# EasyEDA Pro project ProProject_zelda_guardian.epro, board main_pcb
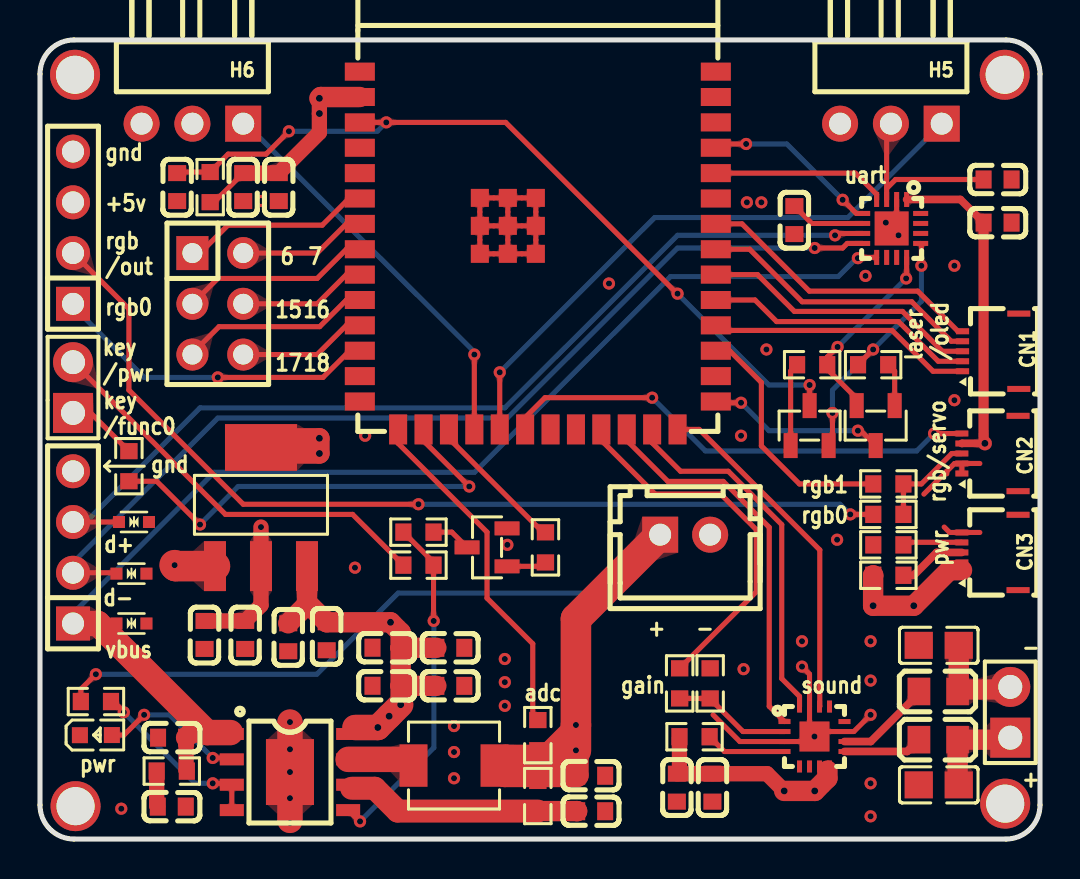
[diagram p10: board, top side]
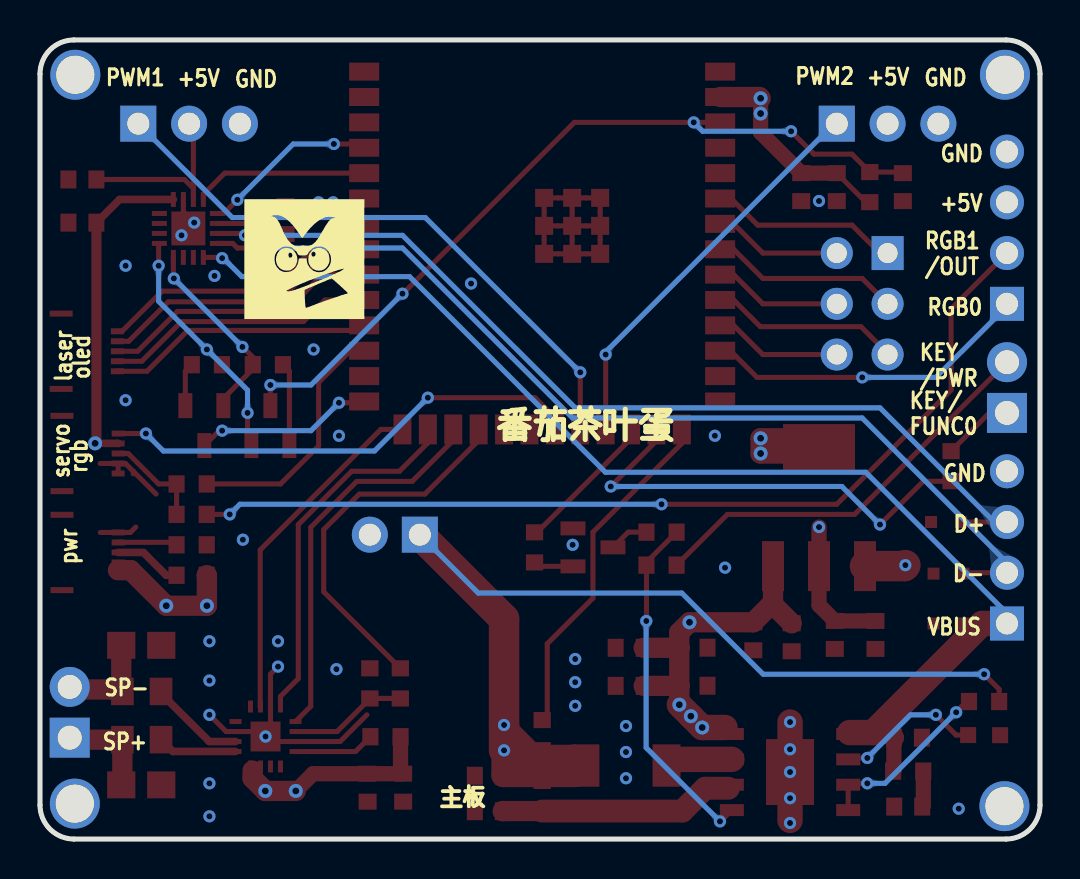
[diagram p11: board, bottom side, seen from below]

Outline 50 x 40 mm; copper layers: Top Layer, 地层, 电源层, Bottom Layer. Coordinates in mm from the lower left corner of the outline.
Outline path: 0,38.3 0,1.7 arc(0.5,0.5) 1.7,0 48.3,0 arc(49.5,0.5) 50,1.7 50,38.3 arc(49.5,39.5) 48.3,40 1.7,40 arc(0.5,39.5) 0,38.3
Stack: Top Layer 0.035mm / Dielectric1 0.48mm PP er 4.5 / 地层 0.035mm / Dielectric2 0.48mm FR4 er 4.5 / 电源层 0.035mm / Dielectric3 0.48mm PP er 4.5 / Bottom Layer 0.035mm

## Design rules (mm)
template: 自定义配置
spacing copperThickness1oz (default): track to track 0.102, other pairs 0.152 to 0.3
spacing copperThickness2oz: track to track 0.203, other pairs 0.152 to 0.3
track width copperThickness1oz (default): min 0.127, default 0.254, max 2.54
track width copperThickness2oz: min 0.203, default 0.254, max 2.54
differential pair differentialPair (default): width min 0.127, default 0.254, max 2.54; gap min 0.152, default 0.152
via viaSize (default): diameter min 0.5, default 0.61, max 10; hole min 0.3, default 0.305, max 6.299
net GND uses 焊盘直连
net +5V uses 焊盘直连

## Placement (name value [footprint] x y rotation side)
C1  10uF  [C0603]  6.59 1.62 180 top
C2  10uF  [C0603]  6.6 5.07 0 top
C3  22uF  [C0603]  17.32 9.58 180 top
C4  22uF  [C0603]  27.56 1.39 0 top
C5  22uF  [C0603]  17.32 7.67 180 top
C6  22uF  [C0603]  27.56 3.17 0 top
C7  22uF  [C0603]  20.52 7.67 0 top
C8  22uF  [C0603]  20.52 9.57 0 top
C9  10uF  [C0603]  14.33 10.15 90 top
C10  100nF  [C0603]  12.41 10.1 90 top
C11  10uF  [C0603]  10.26 10.22 90 top
C12  100nF  [C0603]  8.23 10.22 90 top
C13  10uF  [C0603]  10.16 32.63 90 top
C14  1uF  [C0603]  6.86 32.63 90 top
C15  100nF  [C0603]  11.94 32.63 90 top
C16  1uF  [C0603]  47.88 30.86 180 top
C17  1uF  [C0603]  47.88 33.01 180 top
C18  100nF  [C0603]  37.72 30.98 90 top
C19  10uF  [C0603]  33.62 2.57 270 top
C20  100nF  [C0603]  31.84 2.57 270 top
C21  220pF  [C0805]  44.94 2.71 0 top
C22  220pF  [C0805]  44.94 9.7 0 top
CN1  0.5K-QX-5PWB  [FPC-SMD_5P-P0.50_HDGC_0.5K-QX-5PWB]  47.54 24.42 90 top
CN2  0.5K-QX-5PWB  [FPC-SMD_5P-P0.50_HDGC_0.5K-QX-5PWB]  47.5 19.3 90 top
CN3  0.5K-QX-5PWB  [FPC-SMD_5P-P0.50_HDGC_0.5K-QX-5PWB]  47.5 14.35 90 top
CN4  HX25003-2A  [CONN-TH_2P-P2.50_HX25003-2A]  32.26 15.23 0 top
D1  LESD5D5.0CT1G  [SOD-523_L1.2-W0.8-LS1.6-BI]  4.57 10.79 180 top
D2  LESD5D5.0CT1G  [SOD-523_L1.2-W0.8-LS1.6-BI]  4.57 13.28 180 top
D3  LESD5D5.0CT1G  [SOD-523_L1.2-W0.8-LS1.6-BI]  4.7 15.87 180 top
H2  DS1023-2*3SF11  [HDR-TH_6P-P2.54-V-F-R2-C3-S2.54]  8.89 26.79 270 top
H3  PZ254V-11-02P  [HDR-TH_2P-P2.54-V-M]  1.65 22.6 90 top
H4  PZ254V-11-02P  [HDR-TH_2P-P2.54-V-M]  48.51 6.34 90 top
H5  PZ254R-11-03P  [HDR-TH_3P-P2.54-H-M-W10.4]  42.54 35.81 180 top
H6  PZ254R-11-03P  [HDR-TH_3P-P2.54-H-M-W10.4]  7.62 35.81 180 top
H7  PZ254V-11-04P  [HDR-TH_4P-P2.54-V-M]  1.65 30.6 90 top
H8  PZ254V-11-04P  [HDR-TH_4P-P2.54-V-M]  1.65 14.6 90 top
L1  1uH  [IND-SMD_L4.4-W4.2]  20.7 3.68 180 top
L2  GZ2012D101TF  [L0805]  44.91 4.97 0 top
L3  GZ2012D101TF  [L0805]  44.91 7.39 0 top
LED1  KT-0603R  [LED0603-RD]  2.79 5.2 0 top
NOREF  -  [Pad_e411]  1.78 1.65 0 top
NOREF#2  -  [Pad_e412]  48.26 1.77 0 top
NOREF#3  -  [Pad_e107]  1.75 38.26 0 top
NOREF#4  -  [Pad_e108]  48.24 38.26 0 top
Q1  SS8050  [SOT-23-3_L2.9-W1.3-P1.90-LS2.4-BR]  38.48 20.7 270 top
Q2  SS8050  [SOT-23-3_L2.9-W1.3-P1.90-LS2.4-BR]  41.78 20.7 90 top
Q3  SS8050  [SOT-23-3_L2.9-W1.3-P1.90-LS2.4-BR]  22.35 14.6 0 top
R1  2Ω  [R0603]  6.59 3.4 0 top
R2  1kΩ  [R0603]  2.8 6.88 0 top
R3  500mΩ  [R0603]  24.89 2.15 90 top
R4  10kΩ  [R0603]  24.89 5.2 90 top
R5  10kΩ  [R0603]  8.51 32.63 270 top
R6  10kΩ  [R0603]  38.61 23.74 0 top
R7  10kΩ  [R0603]  41.66 23.74 180 top
R8  1MΩ  [R0603]  32.73 5.12 0 top
R9  0Ω  [R0603]  31.98 7.79 270 top
R10  100kΩ  [R0603]  33.51 7.79 270 top
R12  0Ω  [R0603]  42.42 14.73 0 top
R13  0Ω  [R0603]  42.42 17.77 180 top
R14  0Ω  [R0603]  42.42 16.25 180 top
R15  0Ω  [R0603]  42.42 13.2 180 top
R16  10kΩ  [R0603]  18.92 13.71 180 top
R17  1kΩ  [R0603]  25.27 14.6 270 top
R18  1kΩ  [R0603]  18.92 15.36 180 top
R19  10kΩ  [R0603]  4.44 18.66 90 top
U1  IP5306  [ESOP-8_L4.9-W3.9-P1.27-LS6.0-BL-EP]  12.5 3.35 270 top
U2  AMS1117-3.3  [SOT-223-3_L6.5-W3.4-P2.30-LS7.0-BR]  11.05 16.63 270 top
U3  ESP32-S3-WROOM-1-N8  [wifim-smd_esp32-s3-wroom-1-n8]  24.89 29.46 0 top
U4  CH343P  [TQFN-16_L3.0-W3.0-P0.50-BL-EP1.7]  42.58 30.56 180 top
U5  MAX98357AETE+T  [TQFN-16_L3.0-W3.0-P0.50-BL-EP1.5]  38.72 5.13 270 top

## Footprints (pads in the part's own frame, mm; a bottom-side part is the same pattern mirrored in y, then rotated)
C0603
  rect 0.8x0.9 smd: 1(-0.7,0) 2(0.7,0)
C0805
  rect 1.41x1.35 smd: 1(-1,0) 2(1,0)
CONN-TH_2P-P2.50_HX25003-2A
  rect 1.8x1.8 hole 1.1: 1(-1.25,0)
  round 1.8 hole 1.1: 2(1.25,0)
ESOP-8_L4.9-W3.9-P1.27-LS6.0-BL-EP
  rect 0.6x1.2 smd: 1(-1.905,-2.909) 2(-0.635,-2.909) 3(0.635,-2.909) 4(1.905,-2.909) 5(1.905,2.909) 6(0.635,2.909) 7(-0.635,2.909) 8(-1.905,2.909)
  rect 3.3x2.4 smd: 9(0,0)
FPC-SMD_5P-P0.50_HDGC_0.5K-QX-5PWB
  rect 0.3x0.65 smd: 1(-1,1.405) 2(-0.5,1.405) 3(0,1.405) 4(0.5,1.405) 5(1,1.405)
  rect 0.3x1.15 smd: 6(1.885,-1.405) 7(-1.885,-1.405)
HDR-TH_2P-P2.54-V-M
  rect 2x2 hole 1.2: 1(-1.27,0)
  round 2 hole 1.2: 2(1.27,0)
HDR-TH_3P-P2.54-H-M-W10.4
  rect 1.8x1.8 hole 1.1: 1(-2.54,0)
  round 1.8 hole 1.1: 2(0,0) 3(2.54,0)
HDR-TH_4P-P2.54-V-M
  rect 1.7x1.7 hole 1.1: 1(-3.81,0)
  round 1.7 hole 1.1: 2(-1.27,0) 3(1.27,0) 4(3.81,0)
HDR-TH_6P-P2.54-V-F-R2-C3-S2.54
  rect 1.7x1.6 hole 1: 1(-2.54,-1.27)
  round 1.6 hole 1: 2(-2.54,1.27) 3(0,-1.27) 4(0,1.27) 5(2.54,-1.27) 6(2.54,1.27)
IND-SMD_L4.4-W4.2
  rect 1.4x2.12 smd: 1(2.028,0) 2(-2.028,0)
L0805
  rect 1.133x1.377 smd: 1(-0.966,0) 2(0.966,0)
LED0603-RD
  rect 0.8x0.8 smd: 1(-0.799,-0.004) 2(0.799,0.004)
Pad_e107
  round 2.5 hole 1.905: 1(0,0)
Pad_e108
  round 2.5 hole 1.905: 2(0,0)
Pad_e411
  round 2.5 hole 1.905: 3(0,0)
Pad_e412
  round 2.5 hole 1.905: 4(0,0)
R0603
  rect 0.806x0.864 smd: 1(-0.753,0) 2(0.753,0)
SOD-523_L1.2-W0.8-LS1.6-BI
  rect 0.6x0.6 smd: 1(-0.75,0) 2(0.75,0)
SOT-23-3_L2.9-W1.3-P1.90-LS2.4-BR
  rect 1.25x0.7 smd: 1(1,-0.95) 2(1,0.95) 3(-1,0)
SOT-223-3_L6.5-W3.4-P2.30-LS7.0-BR
  rect 2.5x1.1 smd: 1(2.97,-2.3) 2(2.97,0) 3(2.97,2.3)
  rect 2.34x3.6 smd: 4(-2.97,0)
TQFN-16_L3.0-W3.0-P0.50-BL-EP1.5
  rect 0.25x0.6 smd: 1(-0.749,-1.5) 2(-0.248,-1.5) 3(0.252,-1.5) 4(0.751,-1.5) 9(0.75,1.5) 10(0.25,1.5) 11(-0.25,1.5) 12(-0.749,1.5)
  rect 0.6x0.25 smd: 5(1.5,-0.748) 6(1.5,-0.248) 7(1.5,0.252) 8(1.5,0.752) 13(-1.5,0.752) 14(-1.5,0.252) 15(-1.5,-0.248) 16(-1.5,-0.748)
  rect 1.5x1.5 smd: 17(0,0)
TQFN-16_L3.0-W3.0-P0.50-BL-EP1.7
  rect 0.25x0.75 smd: 1(-0.749,-1.45) 2(-0.248,-1.45) 3(0.252,-1.45) 4(0.751,-1.45) 9(0.75,1.45) 10(0.25,1.45) 11(-0.25,1.45) 12(-0.749,1.45)
  rect 0.75x0.25 smd: 5(1.45,-0.75) 6(1.45,-0.25) 7(1.45,0.25) 8(1.45,0.75) 13(-1.45,0.75) 14(-1.45,0.25) 15(-1.45,-0.25) 16(-1.45,-0.75)
  rect 1.7x1.7 smd: 17(0.001,0)
wifim-smd_esp32-s3-wroom-1-n8
  rect 1.5x0.9 smd: 1(-8.9,8.954) 2(-8.9,7.684) 3(-8.9,6.415) 4(-8.9,5.144) 5(-8.9,3.874) 6(-8.9,2.604) 7(-8.9,1.335) 8(-8.9,0.065) 9(-8.9,-1.206) 10(-8.9,-2.475) 11(-8.9,-3.745) 12(-8.9,-5.016) 13(-8.9,-6.285) 14(-8.9,-7.556) 27(8.9,-7.556) 28(8.9,-6.285) 29(8.9,-5.016) 30(8.9,-3.745) 31(8.9,-2.475) 32(8.9,-1.206) 33(8.9,0.065) 34(8.9,1.335) 35(8.9,2.604) 36(8.9,3.874) 37(8.9,5.144) 38(8.9,6.415) 39(8.9,7.684) 40(8.9,8.954)
  rect 0.9x1.5 smd: 15(-6.985,-8.954) 16(-5.715,-8.954) 17(-4.445,-8.954) 18(-3.175,-8.954) 19(-1.905,-8.954) 20(-0.635,-8.954) 21(0.635,-8.954) 22(1.905,-8.954) 23(3.175,-8.954) 24(4.445,-8.954) 25(5.715,-8.954) 26(6.985,-8.954)
  rect 0.9x0.9 smd: 41(-2.9,2.635) 41(-2.9,1.235) 41(-2.9,-0.165) 41(-1.5,2.635) 41(-1.5,1.235) 41(-1.5,-0.165) 41(-0.1,2.635) 41(-0.1,1.235) 41(-0.1,-0.165)

## Nets
As in the schematic.

Pads without a net: NOREF 3; NOREF#2 4; NOREF#3 1; NOREF#4 2; U3 4 5 13 14 21 22 28 35 38 39; U4 10 11 14 15 16; U5 5 6 12 13

## Via types
v1: diameter 0.61, hole 0.305, Top Layer to Bottom Layer, 72 vias
v2: diameter 0.7, hole 0.35, Top Layer to Bottom Layer, 9 vias
v3: diameter 0.701, hole 0.35, Top Layer to Bottom Layer, 4 vias

## Routing (per net, layer and track width the routed paths; a pad name or vN(x,y) marks a point on that pad's centre or on a via; arc(x,y) is an arc through that point)
3V3: length 96.9
  Top Layer w0.254: C13.2 8.71,31.88 R5.2
  Top Layer w0.381: 43.33,32.01 46.02,32.01 C16.2 ; CN2.4 46.1,19.81 v2(47.24,19.81)
  Top Layer w0.508: C16.2 47.18,19.87 v2(47.24,19.81)
  Top Layer w0.762: C12.2 C11.2 11.05,11.71 U2.2 v1(11.05,15.62) ; v2(13.97,37.08) v2(13.97,36.32) 13.97,35.37 C15.2 C13.2
  Top Layer w1.016: v2(13.97,37.08) 14.03,37.14 U3.2 ; v2(13.97,20.06) 11.51,20.06 U2.4 11.35,19.3 v2(13.97,19.3) v2(13.97,20.06)
  电源层 w0.381: v1(11.05,15.62) 11.05,15.74 13.97,18.66
  电源层 w0.762: v2(47.24,19.81) 46.48,19.04 14.22,19.04 v2(13.97,19.3)
  电源层 w1.524: v2(13.97,37.08) v2(13.97,36.32) v2(13.97,20.06) v2(13.97,19.3)
+5V: length 44.6
  Top Layer w0.254: H5.2 42.33,35.59 42.33,32.57 ; 42.33,32.57 42.78,33.01 C17.2 ; 42.33,32.57 42.33,32.01
  Top Layer w0.762: R8.1 31.97,3.4 C20.1 C19.1 36.35,3.27 v3(37.21,2.41)
  Top Layer w1.016: 18.03,9.57 18.03,9.57 18.03,9.57 ; 18.03,9.57 18.03,10.34 v2(17.53,10.85) C9.2 13.35,11.84 ; 18.03,9.57 C8.1 ; 18.03,9.57 18.03,9.57 ; 18.03,7.67 C7.1 ; 18.03,7.67 v2(18.03,6.73) ; 18.03,7.67 18.03,9.57 ; 18.03,7.67 18.03,7.67 C5.1 ; 46.1,13.46 45.47,13.46 v3(43.69,11.68) v3(41.66,11.68) 41.66,13.19 R15.2 ; 13.35,13.66 13.35,11.84 ; 13.35,11.84 13.35,11.74 C10.2 ; 39.37,3.42 39.37,3.04 v3(38.74,2.41) v3(37.21,2.41)
  Top Layer w1.27: v2(18.03,6.73) v2(17.46,6.15) v2(16.89,5.58) 15.75,5.58
GND: length 43.8
  Top Layer w0.254: 45.34,18.41 44.2,17.27 ; 45.34,18.41 45.72,18.79 46.09,18.79 CN2.2 ; 45.34,18.41 45.34,18.28 ; 23.39,30.69 U3.41 ; U3.41 U3.41 ; U3.41 24.79,29.29 ; U3.41 24.79,31.39 ; U3.41 U3.41 21.99,31.39 21.99,30.69 ; U3.41 U3.41 24.79,31.39 ; 46.99,15.35 CN3.5 45.48,15.35 45.21,15.62 ; v1(38.72,5.13) 38.97,5.38 U5.11 40.69,5.38 v1(41.53,6.22) ; v1(38.72,5.13) 38.48,5.38 U5.15 38.48,8.25 v1(38.1,8.63) ; v1(38.72,5.13) 38.47,4.88 U5.3 34.99,4.88 33.66,6.22 ; v1(42.29,30.86) 42.83,31.4 42.83,32.01 ; 23.39,29.29 U3.41 ; U3.41 U3.41 U3.41 21.99,29.99 U3.41 U3.41 ; CN2.2 CN2.1 ; CN2.2 46.99,18.8 ; CN2.2 46.1,18.79
  Top Layer w1.27: 12.5,0.94 v1(12.5,2.05) v1(12.5,3.35) v1(12.5,4.49) v1(12.5,5.86)
  Top Layer w1.524: U2.1 6.78,13.66 v1(6.73,13.71)
  vias: v1(4.06,1.52) v1(11.05,31.94) v1(12.5,0.8) v1(15.75,13.58) v1(16.26,20.19) v1(20.7,5.66) v1(20.7,4.35) v1(20.7,3.04) v1(23.24,9.01) v1(23.24,7.85) v1(23.24,6.67) v1(23.37,14.73) v1(28.45,27.81) v1(35.05,20.19) v1(35.18,8.5) v1(35.34,31.87) v1(36.07,31.87) v1(36.32,24.51) v1(38.1,9.9) v1(39.85,14.98) v1(41.28,28.19) v1(41.53,9.9) v1(41.53,7.93) v1(41.53,2.79) v1(41.53,1.14) v1(42.93,30.22) v1(45.72,28.7) v1(45.72,21.97)
VBUS: length 62
  Top Layer w0.254: 2.89,10.79 D1.2 ; U4.9 40.93,29.11 v1(40.89,29.08)
  Top Layer w0.762: C2.2 7.3,3.44 R1.2
  Top Layer w1.016: 8.35,5.33 7.56,5.33 C2.2
  Top Layer w1.27: 9.52,5.33 8.35,5.33 2.89,10.79 H8.1
  Bottom Layer w0.254: H8.1 1.65,11.3 8.71,18.36 21.73,18.36 31.52,28.15 39.91,28.15 40.83,29.08 v1(40.89,29.08)
B_ADC: length 17.4
  Top Layer w0.254: R4.2 24.64,6.21 24.64,9.77 22.35,12.06 22.35,15.36 17.91,19.81 17.91,20.5
BAT: length 69.9
  Top Layer w0.254: v1(2.79,8.25) 2.04,7.5 2.04,6.88
  Top Layer w1.016: 25.3,4.21 26.8,4.21 ; 25.3,4.21 23.26,4.21 L1.2 ; 25.3,4.21 v1(26.8,5.71) ; 26.8,3.23 C6.1
  Top Layer w1.143: L1.2 23.24,3.17 C6.1
  Top Layer w1.27: 26.8,3.23 v1(26.8,4.44)
  Top Layer w1.524: v1(26.8,4.44) v1(26.8,5.71) 26.8,11.02 CN4.1
  电源层 w1.143: v1(26.8,4.44) v1(26.8,5.71) 26.8,11.02 CN4.1
  Bottom Layer w0.254: CN4.1 28.09,12.31 17.91,12.31 13.84,8.25 v1(2.79,8.25)
CHIP_PU: length 40.5
  Top Layer w0.254: v1(12.45,35.43) 11.3,34.28 9.41,34.28 R5.1 6.91,33.39 C14.2 ; v1(38.48,22.73) Q1.3 ; v1(31.88,27.3) 31.85,27.3 23.28,35.87 v1(17.31,35.87) U3.3
  Bottom Layer w0.254: v1(31.88,27.3) 36.45,22.73 v1(38.48,22.73) ; v1(12.45,35.43) 16.87,35.43 v1(17.31,35.87)
D+: length 47.8
  Top Layer w0.254: H8.3 D3.2 ; 41.13,30.31 39.84,30.31 v1(39.75,30.22)
  Bottom Layer w0.254: H8.3 2.29,15.87 8,21.58 23.24,21.58 31.88,30.22 v1(39.75,30.22)
D-: length 48.8
  Top Layer w0.254: U4.8 40.36,29.81 40.13,29.59 v1(38.74,29.59) ; 1.65,13.33 3.78,13.33 D2.2
  Bottom Layer w0.254: 1.65,13.33 1.65,13.84 8.89,21.08 23.37,21.08 31.88,29.59 v1(38.74,29.59)
DTR: length 9.7
  Top Layer w0.254: U4.12 43.33,28.09 v1(43.31,28.06) ; Q2.2 40.83,22.05 39.36,23.53 R6.2 39.36,24.12 39.87,24.63 v1(39.88,24.63)
  Bottom Layer w0.254: v1(39.88,24.63) v1(43.31,28.06)
GPIO0: length 8.9
  Top Layer w0.254: v1(40.89,20.44) 41.04,20.44 Q2.3 ; v1(35.05,21.84) 33.86,21.84 U3.27
  Bottom Layer w0.254: v1(40.89,20.44) 36.45,20.44 v1(35.05,21.84)
GPIO6: length 9.5
  Top Layer w0.254: U3.6 15.45,32.06 14.11,30.73 9.4,30.73 8,29.33 H2.1
GPIO7: length 6.4
  Top Layer w0.254: H2.2 13.86,29.33 15.32,30.79 U3.7
GPIO15: length 9.5
  Top Layer w0.254: U3.8 15.32,29.52 13.86,28.06 8.89,28.06 H2.3
GPIO16: length 6.4
  Top Layer w0.254: H2.4 13.86,26.79 15.32,28.25 U3.9
GPIO17: length 9.5
  Top Layer w0.254: U3.10 15.32,26.98 13.98,25.65 8.95,25.65 7.62,24.32 7.62,24.25
GPIO18: length 6.4
  Top Layer w0.254: U3.11 15.32,25.71 13.86,24.25 10.16,24.25
I2S_BCLK: length 18.3
  Top Layer w0.254: U3.25 30.61,19.83 32.03,18.41 34.42,18.41 37.09,15.74 37.09,8.03 37.98,7.14 U5.16
I2S_DATA: length 19.5
  Top Layer w0.254: U3.24 29.34,19.96 31.39,17.9 34.16,17.9 36.46,15.6 36.46,6.64 U5.1
I2S_GAIN: length 18.7
  Top Layer w0.254: R9.1 35.81,12.38 35.81,15.49 34.04,17.27 30.76,17.27 28.07,19.96 U3.23
I2S_WS: length 17.5
  Top Layer w0.254: U5.14 38.99,6.65 38.99,14.47 32.96,20.5 U3.26
KEY: length 17.5
  Top Layer w0.254: U1.5 15.97,0.88 v1(16,0.88) ; R18.2 19.68,13.86 R16.1 19.68,10.93 v1(19.69,10.92)
  Bottom Layer w0.254: v1(19.69,10.92) 19.69,10.91 19.69,4.58 v1(16,0.88)
KEY_FUNC0: length 22.5
  Top Layer w0.254: v1(21.46,17.65) 19.18,19.93 U3.16 ; v1(8,15.74) 5.83,17.91 R19.1
  Bottom Layer w0.254: v1(8,15.74) 9.91,17.65 v1(21.46,17.65)
KEY_PWR: length 20.7
  Top Layer w0.254: H3.2 9.27,16.25 15.63,16.25 R16.2
LASER: length 13.3
  Top Layer w0.254: U3.30 34.05,25.46 42.61,25.46 44.65,23.42 CN1.1
OLED_CLK: length 14.2
  Top Layer w0.254: U3.33 35.48,29.52 38.11,26.89 43.59,26.89 45.56,24.92 CN1.4
OLED_DATA: length 13.6
  Top Layer w0.254: U3.31 35.75,26.98 36.83,25.9 42.93,25.9 44.91,23.92 CN1.2
OLED_DC: length 14.6
  Top Layer w0.254: U3.34 35.1,30.79 38.47,27.43 43.89,27.43 45.9,25.42 CN1.5
OLED_RST: length 13.9
  Top Layer w0.254: U3.32 35.88,28.25 37.72,26.41 43.13,26.41 45.12,24.42 CN1.3
PWM0: length 24.3
  Top Layer w0.254: U3.20 24.26,21.1 25.25,22.09 v1(30.61,22.09) ; CN2.5 v1(44.7,20.3)
  Bottom Layer w0.254: v1(44.7,20.3) 43.83,19.43 33.27,19.43 v1(30.61,22.09)
PWM1: length 30.1
  Top Layer w0.254: v1(22.99,23.36) U3.19
  Bottom Layer w0.254: H5.1 40.39,31.11 30.73,31.11 v1(22.99,23.36)
PWM2: length 20.2
  Top Layer w0.254: 21.72,24.31 U3.18
  Bottom Layer w0.254: H6.1 10.29,35.81 21.72,24.38 v1(21.72,24.25)
PWR_CTRL: length 7.2
  Top Layer w0.254: R17.1 25.15,15.35 20.45,20.05 U3.17
RGB_D0: length 16.5
  Top Layer w0.254: U3.12 15.48,24.44 14.15,23.11 v1(8.89,23.11)
  Bottom Layer w0.254: H7.1 1.65,26.66 5.21,23.11 v1(8.89,23.11)
RGB_D1: length 12.5
  Top Layer w0.254: U3.29 34.48,24.44 36.07,22.85 36.07,19.68 37.97,17.77 R13.2
RGB_DOUT: length 47.8
  Top Layer w0.254: v1(18.92,16.76) 10.16,16.76 4.44,22.47 4.44,26.54 H7.2 ; R14.2 v1(40.51,16.25)
  Bottom Layer w0.254: v1(18.92,16.76) 40,16.76 v1(40.51,16.25)
RSV1: length 3
  Top Layer w0.254: CN3.4 46.09,14.85 43.3,14.85 R12.2
RSV2: length 3.4
  Top Layer w0.381: R15.1 43.69,13.2 44.83,14.35 CN3.3
RTS: length 13.1
  Top Layer w0.254: v1(39.62,21.33) 39.62,19.89 39.43,19.7 ; R7.2 40.9,23.75 v1(41.66,24.51) ; U4.13 44.07,29.78 v1(44.07,28.7)
  Bottom Layer w0.254: v1(44.07,28.7) 44.07,26.92 v1(41.66,24.51) 39.62,22.47 v1(39.62,21.33)
SP+: length 5
  Top Layer w1.016: C21.2 45.88,2.77 L2.2 48.49,4.97 48.51,5 H4.1
SP-: length 5
  Top Layer w1.016: 45.98,7.49 45.94,7.53 C22.2 ; 45.98,7.49 L3.2 ; 45.98,7.49 48.39,7.49 H4.2
U0RXD: length 8.7
  Top Layer w0.254: U3.36 40.77,33.33 41.83,32.27 U4.4
U0TXD: length 8.9
  Top Layer w0.254: U3.37 33.98,34.79 v1(35.31,34.79) ; 41.13,31.31 40.82,31.31 v1(40.13,32)
  Bottom Layer w0.254: v1(35.31,34.79) 37.34,34.79 v1(40.13,32)
$1N5557: length 3.8
  Top Layer w0.254: U4.6 38.59,30.81 C18.2
$1N5576: length 4.2
  Top Layer w0.254: R6.1 37.53,23.42 Q1.1
$1N5577: length 2.2
  Top Layer w0.254: R7.1 42.73,23.42 Q2.1
$2N1116: length 1.8
  Top Layer w0.762: R1.1 5.83,1.68 C1.2
$2N1258: length 3.4
  Top Layer w1.27: L1.1 18.36,3.99 U1.7
$2N1709: length 11.8
  Top Layer w1.016: R3.1 26.85,1.4 C4.1
  Top Layer w1.143: 15.58,2.54 16.74,2.54 17.88,1.4 R3.1
$2N2001: length 7.3
  Top Layer w0.254: v1(5.21,6.22) 4.19,5.21 LED1.2 ; U1.2 9.52,4.06 v1(8.64,4.06)
  Bottom Layer w0.254: v1(8.64,4.06) 6.48,6.22 v1(5.21,6.22)
$2N2011: length 9
  Top Layer w0.254: R2.2 3.68,6.88 4.19,6.37 v1(4.19,6.34) ; U1.4 U1.3 9.52,2.79 v1(8.64,2.79)
  Bottom Layer w0.254: v1(4.19,6.34) 7.75,2.79 v1(8.64,2.79)
$2N4252: length 2
  Top Layer w0.254: Q3.3 20.59,15.36 R18.1
$2N4254: length 2
  Top Layer w0.254: R17.2 25.08,13.65 Q3.1
$3N1741: length 5.1
  Top Layer w0.254: R14.1 R13.1 44.07,17.77 45.59,19.3 CN2.3
$3N8051: length 3.6
  Top Layer w0.254: R19.2 2.53,21.33 H3.1
$4N470: length 4.1
  Top Layer w0.254: U5.4 34.22,4.38 R8.2
$4N475: length 4
  Top Layer w0.381: U5.9 43.36,4.38 L2.1
$4N476: length 4.8
  Top Layer w0.381: U5.10 41.54,4.88 43.95,7.29 L3.1
$4N494: length 5.9
  Top Layer w0.254: 33.5,7.04 R10.2 ; 33.5,7.04 R9.2 ; 33.5,7.04 33.5,7.03 35.15,5.38 U5.2

## Copper pours and planes (outline as drawn; the poured copper is in the pictures)
+5V on 电源层: -2.79,43.56 52.83,43.56 52.83,-2.55 -2.79,-2.55
GND on Top Layer: -5.46,47.62 50.42,47.62 50.42,-0.51 -5.46,-0.51
GND on Bottom Layer: -1.4,41.65 54.48,41.65 54.48,-4.2 -1.4,-4.2
GND on 地层: -4.06,45.71 51.69,45.71 51.69,-1.78 -4.06,-1.78

Small or netless copper shapes (teardrops, artwork), in the pictures only: 231 on Top Layer, 40 on Bottom Layer, 2 on 电源层

## Text on the board
Bottom Silkscreen Layer: D+ | D- | GND | +5V | RGB0 | VBUS | RGB1 / /OUT | KEY / /PWR | KEY/ / FUNC0 | PWM2 | PWM1 | SP- | SP+ | oled | rgb | pwr | laser | servo | 主板 | 番茄茶叶蛋
Top Silkscreen Layer: pwr | key / /pwr | d- | key / /func0 | d+ | gnd | +5v | rgb / /out | rgb0 | vbus | 15 | 17 | 6 | 16 | 18 | 7 | adc | gain | +   - | rgb1 | sound | uart | - | + | rgb/servo | laser / /oled
